# EAGLE schematic AuxilaryWiring (EAGLE 7.6.0)
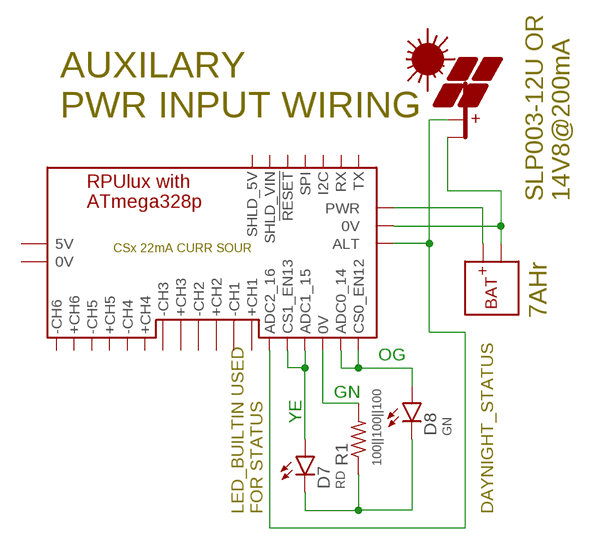
[diagram p0: schematic, sheet 1]

## Parts
D7  RD  LED5MM  [LED5MM]
D8  GN  LED5MM  [LED5MM]
PV4  PV  [NA-30]
R1  100||100||100  R0805  [C0805(2012)]
U$1  RPULUX  [WITH_RPU_NAMES]
U$7  BAT  [NA-30]

## Nets
GN: R1.2 U$1.0V@DIO2(0V)
N$15: U$1.PWR U$7.1(+BAT)
N$42: PV4.2(-PV) U$1.0V@PWR(0V) U$7.2(-BAT)
N$50: PV4.1(+PV) U$1.ADC2(ADC2_16) U$1.AUX(ALT)
OG: D8.A U$1.22MA@ADC0(CS0_EN12) U$1.ADC0(ADC0_14)
RD: D7.K D8.K R1.1
YE: D7.A U$1.22MA@ADC1(CS1_EN13) U$1.ADC1(ADC1_15)
Unconnected: U$1.0V U$1.5V U$1.!RESET U$1.+CH1 U$1.+CH2 U$1.+CH3 U$1.+CH4 U$1.+CH5 U$1.+CH6 U$1.-CH1 U$1.-CH2 U$1.-CH3 U$1.-CH4 U$1.-CH5 U$1.-CH6 U$1.I2C U$1.RX U$1.SHLD_5V U$1.SHLD_VOUT(SHLD_VIN) U$1.SPI U$1.TX

## Notes on the sheet
- AUXILARY 
  PWR INPUT WIRING
- SLP003-12U OR
  14V8@200mA
- 7AHr
- LED_BUILTIN USED
  FOR STATUS
- DAYNIGHT_STATUS

## Library data of the parts
D7 D8 = D-LED:LED: LED 120120WH [CREE,XHGAWT-00-0000-00000HXE1] LED WHITE 6500K 150LUM-W120120
PV4 = Documentation:PV
R1 = R-C:R: Resiistor American-style symbol
U$1 = Documentation:RPULUX
U$7 = Documentation:BAT